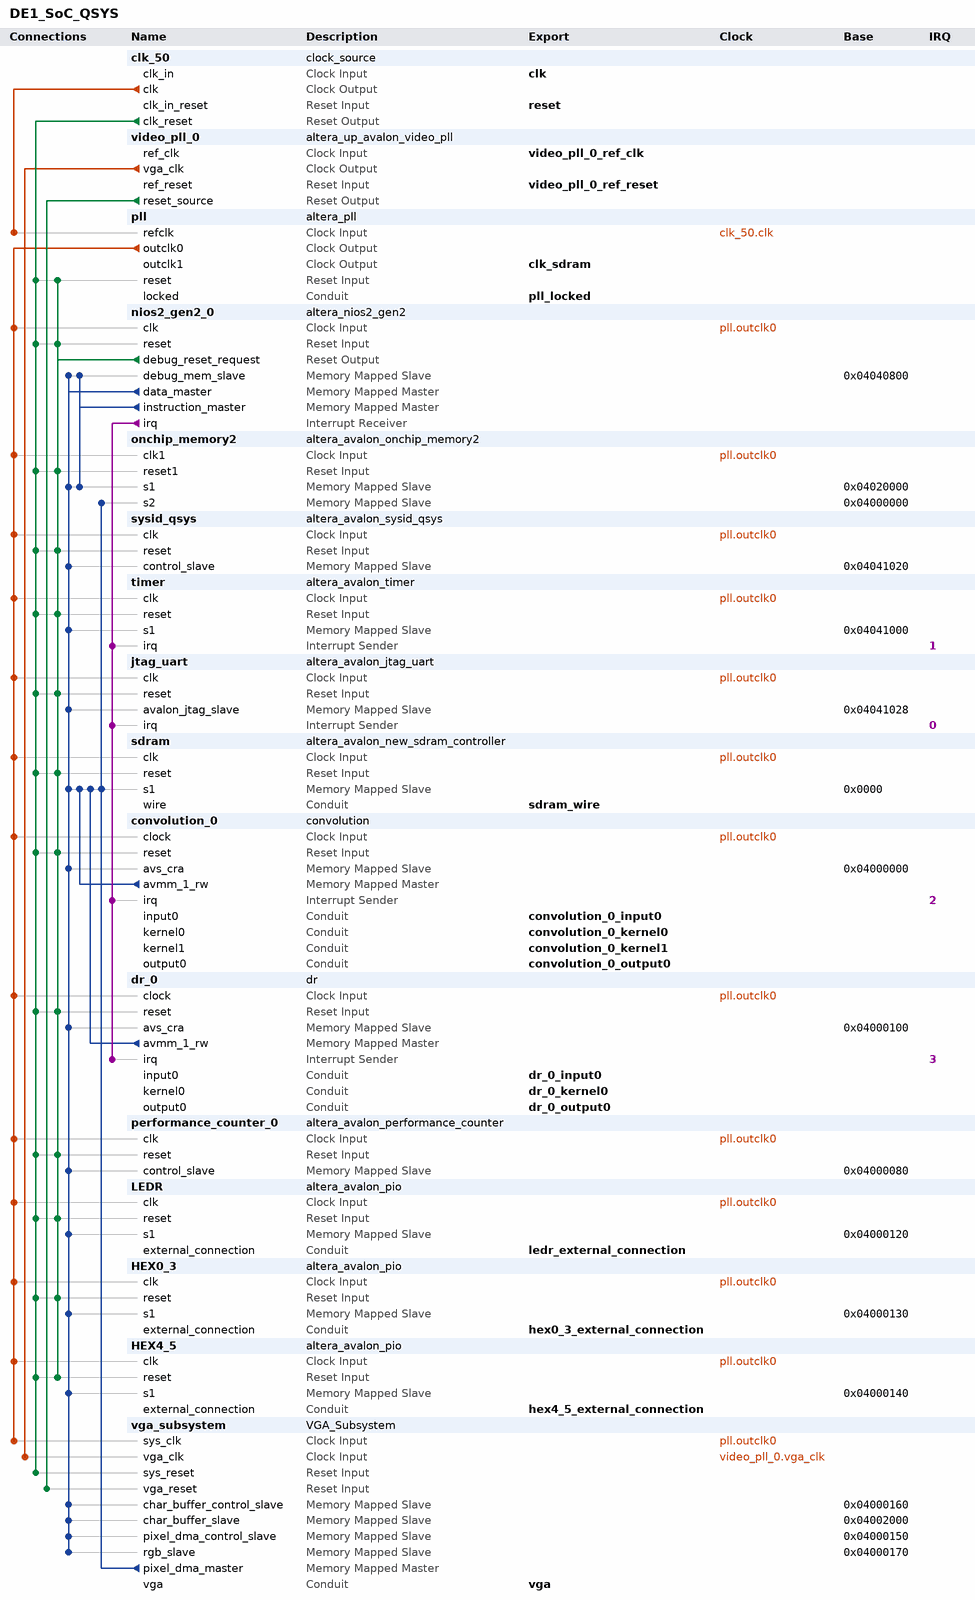
[diagram p0: system contents]
# Platform Designer (Qsys) system DE1_SoC_QSYS, Cyclone V 5CSEMA5F31C6
# Parameters at their usual value, and those the tool derives, are not listed.
package require -exact qsys 18.1
create_system DE1_SoC_QSYS
set_project_property DEVICE_FAMILY {Cyclone V}
set_project_property DEVICE 5CSEMA5F31C6

add_instance clk_50 clock_source 18.1
set_instance_parameter_value clk_50 clockFrequency 50000000

add_instance video_pll_0 altera_up_avalon_video_pll 18.0
set_instance_parameter_value video_pll_0 camera {5MP Digital Camera (THDB_D5M)}
set_instance_parameter_value video_pll_0 gui_refclk 50.0
set_instance_parameter_value video_pll_0 lcd {7" LCD on VEEK-MT and MTL/MTL2 Modules}

add_instance pll altera_pll 18.1
set_instance_parameter_value pll gui_device_speed_grade 2
set_instance_parameter_value pll gui_number_of_clocks 2
set_instance_parameter_value pll gui_operation_mode normal
set_instance_parameter_value pll gui_output_clock_frequency0 143.0
set_instance_parameter_value pll gui_output_clock_frequency1 143.0
set_instance_parameter_value pll gui_phase_shift1 -3800
set_instance_parameter_value pll gui_phase_shift_deg1 -90.0
set_instance_parameter_value pll gui_pll_mode {Integer-N PLL}
set_instance_parameter_value pll gui_reference_clock_frequency 50.0
set_instance_parameter_value pll gui_use_locked true

add_instance nios2_gen2_0 altera_nios2_gen2 18.1
set_instance_parameter_value nios2_gen2_0 dcache_size 2048
set_instance_parameter_value nios2_gen2_0 exceptionSlave onchip_memory2.s1
set_instance_parameter_value nios2_gen2_0 icache_size 4096
set_instance_parameter_value nios2_gen2_0 impl Tiny
set_instance_parameter_value nios2_gen2_0 resetSlave onchip_memory2.s1

add_instance onchip_memory2 altera_avalon_onchip_memory2 18.1
set_instance_parameter_value onchip_memory2 dataWidth 32
set_instance_parameter_value onchip_memory2 dualPort true
set_instance_parameter_value onchip_memory2 initMemContent true
set_instance_parameter_value onchip_memory2 initializationFileName onchip_mem.hex
set_instance_parameter_value onchip_memory2 memorySize 128000
set_instance_parameter_value onchip_memory2 singleClockOperation true

add_instance sysid_qsys altera_avalon_sysid_qsys 18.1
set_instance_parameter_value sysid_qsys id 0

add_instance timer altera_avalon_timer 18.1
set_instance_parameter_value timer period 1
set_instance_parameter_value timer periodUnits MSEC

add_instance jtag_uart altera_avalon_jtag_uart 18.1
set_instance_parameter_value jtag_uart simInteractiveOptions NO_INTERACTIVE_WINDOWS

add_instance sdram altera_avalon_new_sdram_controller 18.1
set_instance_parameter_value sdram TAC 5.4
set_instance_parameter_value sdram TRCD 15.0
set_instance_parameter_value sdram TRP 15.0
set_instance_parameter_value sdram casLatency 3
set_instance_parameter_value sdram columnWidth 10
set_instance_parameter_value sdram dataWidth 16
set_instance_parameter_value sdram generateSimulationModel true
set_instance_parameter_value sdram model single_Micron_MT48LC4M32B2_7_chip
set_instance_parameter_value sdram numberOfBanks 4
set_instance_parameter_value sdram numberOfChipSelects 1
set_instance_parameter_value sdram powerUpDelay 100.0
set_instance_parameter_value sdram refreshPeriod 7.8125
set_instance_parameter_value sdram rowWidth 13

add_instance convolution_0 convolution 1.0

add_instance dr_0 dr 1.0

add_instance performance_counter_0 altera_avalon_performance_counter 18.1
set_instance_parameter_value performance_counter_0 numberOfSections 7

add_instance LEDR altera_avalon_pio 18.1
set_instance_parameter_value LEDR direction Output
set_instance_parameter_value LEDR width 10

add_instance HEX0_3 altera_avalon_pio 18.1
set_instance_parameter_value HEX0_3 direction Output
set_instance_parameter_value HEX0_3 width 32

add_instance HEX4_5 altera_avalon_pio 18.1
set_instance_parameter_value HEX4_5 direction Output
set_instance_parameter_value HEX4_5 width 16

add_instance vga_subsystem VGA_Subsystem 1.0

# connections
add_connection clk_50.clk pll.refclk clock
add_connection pll.outclk0 convolution_0.clock clock
add_connection pll.outclk0 dr_0.clock clock
add_connection pll.outclk0 HEX0_3.clk clock
add_connection pll.outclk0 HEX4_5.clk clock
add_connection pll.outclk0 jtag_uart.clk clock
add_connection pll.outclk0 LEDR.clk clock
add_connection pll.outclk0 nios2_gen2_0.clk clock
add_connection pll.outclk0 onchip_memory2.clk1 clock
add_connection pll.outclk0 performance_counter_0.clk clock
add_connection pll.outclk0 sdram.clk clock
add_connection pll.outclk0 sysid_qsys.clk clock
add_connection pll.outclk0 timer.clk clock
add_connection pll.outclk0 vga_subsystem.sys_clk clock
add_connection video_pll_0.vga_clk vga_subsystem.vga_clk clock
add_connection clk_50.clk_reset convolution_0.reset reset
add_connection clk_50.clk_reset dr_0.reset reset
add_connection clk_50.clk_reset HEX0_3.reset reset
add_connection clk_50.clk_reset HEX4_5.reset reset
add_connection clk_50.clk_reset jtag_uart.reset reset
add_connection clk_50.clk_reset LEDR.reset reset
add_connection clk_50.clk_reset nios2_gen2_0.reset reset
add_connection clk_50.clk_reset onchip_memory2.reset1 reset
add_connection clk_50.clk_reset performance_counter_0.reset reset
add_connection clk_50.clk_reset pll.reset reset
add_connection clk_50.clk_reset sdram.reset reset
add_connection clk_50.clk_reset sysid_qsys.reset reset
add_connection clk_50.clk_reset timer.reset reset
add_connection clk_50.clk_reset vga_subsystem.sys_reset reset
add_connection nios2_gen2_0.debug_reset_request convolution_0.reset reset
add_connection nios2_gen2_0.debug_reset_request dr_0.reset reset
add_connection nios2_gen2_0.debug_reset_request HEX0_3.reset reset
add_connection nios2_gen2_0.debug_reset_request HEX4_5.reset reset
add_connection nios2_gen2_0.debug_reset_request jtag_uart.reset reset
add_connection nios2_gen2_0.debug_reset_request LEDR.reset reset
add_connection nios2_gen2_0.debug_reset_request nios2_gen2_0.reset reset
add_connection nios2_gen2_0.debug_reset_request onchip_memory2.reset1 reset
add_connection nios2_gen2_0.debug_reset_request performance_counter_0.reset reset
add_connection nios2_gen2_0.debug_reset_request pll.reset reset
add_connection nios2_gen2_0.debug_reset_request sdram.reset reset
add_connection nios2_gen2_0.debug_reset_request sysid_qsys.reset reset
add_connection nios2_gen2_0.debug_reset_request timer.reset reset
add_connection video_pll_0.reset_source vga_subsystem.vga_reset reset
add_connection convolution_0.avmm_1_rw sdram.s1 avalon
set_connection_parameter_value convolution_0.avmm_1_rw/sdram.s1 baseAddress 0x0000
add_connection dr_0.avmm_1_rw sdram.s1 avalon
set_connection_parameter_value dr_0.avmm_1_rw/sdram.s1 baseAddress 0x0000
add_connection nios2_gen2_0.data_master convolution_0.avs_cra avalon
set_connection_parameter_value nios2_gen2_0.data_master/convolution_0.avs_cra baseAddress 0x04000000
add_connection nios2_gen2_0.data_master dr_0.avs_cra avalon
set_connection_parameter_value nios2_gen2_0.data_master/dr_0.avs_cra baseAddress 0x04000100
add_connection nios2_gen2_0.data_master HEX0_3.s1 avalon
set_connection_parameter_value nios2_gen2_0.data_master/HEX0_3.s1 baseAddress 0x04000130
add_connection nios2_gen2_0.data_master HEX4_5.s1 avalon
set_connection_parameter_value nios2_gen2_0.data_master/HEX4_5.s1 baseAddress 0x04000140
add_connection nios2_gen2_0.data_master jtag_uart.avalon_jtag_slave avalon
set_connection_parameter_value nios2_gen2_0.data_master/jtag_uart.avalon_jtag_slave baseAddress 0x04041028
add_connection nios2_gen2_0.data_master LEDR.s1 avalon
set_connection_parameter_value nios2_gen2_0.data_master/LEDR.s1 baseAddress 0x04000120
add_connection nios2_gen2_0.data_master nios2_gen2_0.debug_mem_slave avalon
set_connection_parameter_value nios2_gen2_0.data_master/nios2_gen2_0.debug_mem_slave baseAddress 0x04040800
add_connection nios2_gen2_0.data_master onchip_memory2.s1 avalon
set_connection_parameter_value nios2_gen2_0.data_master/onchip_memory2.s1 baseAddress 0x04020000
add_connection nios2_gen2_0.data_master performance_counter_0.control_slave avalon
set_connection_parameter_value nios2_gen2_0.data_master/performance_counter_0.control_slave baseAddress 0x04000080
add_connection nios2_gen2_0.data_master sdram.s1 avalon
set_connection_parameter_value nios2_gen2_0.data_master/sdram.s1 baseAddress 0x0000
add_connection nios2_gen2_0.data_master sysid_qsys.control_slave avalon
set_connection_parameter_value nios2_gen2_0.data_master/sysid_qsys.control_slave baseAddress 0x04041020
add_connection nios2_gen2_0.data_master timer.s1 avalon
set_connection_parameter_value nios2_gen2_0.data_master/timer.s1 baseAddress 0x04041000
add_connection nios2_gen2_0.data_master vga_subsystem.char_buffer_control_slave avalon
set_connection_parameter_value nios2_gen2_0.data_master/vga_subsystem.char_buffer_control_slave baseAddress 0x04000160
add_connection nios2_gen2_0.data_master vga_subsystem.char_buffer_slave avalon
set_connection_parameter_value nios2_gen2_0.data_master/vga_subsystem.char_buffer_slave baseAddress 0x04002000
add_connection nios2_gen2_0.data_master vga_subsystem.pixel_dma_control_slave avalon
set_connection_parameter_value nios2_gen2_0.data_master/vga_subsystem.pixel_dma_control_slave baseAddress 0x04000150
add_connection nios2_gen2_0.data_master vga_subsystem.rgb_slave avalon
set_connection_parameter_value nios2_gen2_0.data_master/vga_subsystem.rgb_slave baseAddress 0x04000170
add_connection nios2_gen2_0.instruction_master nios2_gen2_0.debug_mem_slave avalon
set_connection_parameter_value nios2_gen2_0.instruction_master/nios2_gen2_0.debug_mem_slave baseAddress 0x04040800
add_connection nios2_gen2_0.instruction_master onchip_memory2.s1 avalon
set_connection_parameter_value nios2_gen2_0.instruction_master/onchip_memory2.s1 baseAddress 0x04020000
add_connection vga_subsystem.pixel_dma_master onchip_memory2.s2 avalon
set_connection_parameter_value vga_subsystem.pixel_dma_master/onchip_memory2.s2 baseAddress 0x04000000
add_connection vga_subsystem.pixel_dma_master sdram.s1 avalon
set_connection_parameter_value vga_subsystem.pixel_dma_master/sdram.s1 baseAddress 0x0000
add_connection nios2_gen2_0.irq convolution_0.irq interrupt
set_connection_parameter_value nios2_gen2_0.irq/convolution_0.irq irqNumber 2
add_connection nios2_gen2_0.irq dr_0.irq interrupt
set_connection_parameter_value nios2_gen2_0.irq/dr_0.irq irqNumber 3
add_connection nios2_gen2_0.irq jtag_uart.irq interrupt
set_connection_parameter_value nios2_gen2_0.irq/jtag_uart.irq irqNumber 0
add_connection nios2_gen2_0.irq timer.irq interrupt
set_connection_parameter_value nios2_gen2_0.irq/timer.irq irqNumber 1

# exported interfaces
add_interface clk clock sink
set_interface_property clk EXPORT_OF clk_50.clk_in
add_interface clk_sdram clock source
set_interface_property clk_sdram EXPORT_OF pll.outclk1
add_interface convolution_0_input0 conduit end
set_interface_property convolution_0_input0 EXPORT_OF convolution_0.input0
add_interface convolution_0_kernel0 conduit end
set_interface_property convolution_0_kernel0 EXPORT_OF convolution_0.kernel0
add_interface convolution_0_kernel1 conduit end
set_interface_property convolution_0_kernel1 EXPORT_OF convolution_0.kernel1
add_interface convolution_0_output0 conduit end
set_interface_property convolution_0_output0 EXPORT_OF convolution_0.output0
add_interface dr_0_input0 conduit end
set_interface_property dr_0_input0 EXPORT_OF dr_0.input0
add_interface dr_0_kernel0 conduit end
set_interface_property dr_0_kernel0 EXPORT_OF dr_0.kernel0
add_interface dr_0_output0 conduit end
set_interface_property dr_0_output0 EXPORT_OF dr_0.output0
add_interface hex0_3_external_connection conduit end
set_interface_property hex0_3_external_connection EXPORT_OF HEX0_3.external_connection
add_interface hex4_5_external_connection conduit end
set_interface_property hex4_5_external_connection EXPORT_OF HEX4_5.external_connection
add_interface ledr_external_connection conduit end
set_interface_property ledr_external_connection EXPORT_OF LEDR.external_connection
add_interface pll_locked conduit end
set_interface_property pll_locked EXPORT_OF pll.locked
add_interface reset reset sink
set_interface_property reset EXPORT_OF clk_50.clk_in_reset
add_interface sdram_wire conduit end
set_interface_property sdram_wire EXPORT_OF sdram.wire
add_interface vga conduit end
set_interface_property vga EXPORT_OF vga_subsystem.vga
add_interface video_pll_0_ref_clk clock sink
set_interface_property video_pll_0_ref_clk EXPORT_OF video_pll_0.ref_clk
add_interface video_pll_0_ref_reset reset sink
set_interface_property video_pll_0_ref_reset EXPORT_OF video_pll_0.ref_reset

set_interconnect_requirement {$system} qsys_mm.clockCrossingAdapter HANDSHAKE
set_interconnect_requirement {$system} qsys_mm.maxAdditionalLatency 1

save_system DE1_SoC_QSYS.qsys
